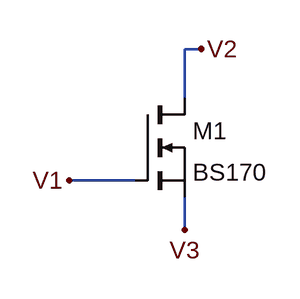
[diagram p0: schematic Draft1.asc]
Draft1.asc, the LTspice schematic file:
Version 4.1
SHEET 1 880 680
WIRE 208 64 192 64
WIRE 192 112 192 64
WIRE 144 192 80 192
WIRE 192 240 192 208
FLAG 80 192 V1
FLAG 208 64 V2
FLAG 192 240 V3
SYMBOL nmos 144 112 R0
SYMATTR InstName M1
SYMATTR Value BS170

The netlist it stands for:
* Draft1.asc
M1 V2 V1 V3 V3 BS170
.model NMOS NMOS
.model PMOS PMOS
.lib standard.mos
.backanno
.end